# EAGLE design Pro Trinket Keyboard V3.4 (EAGLE 7.3.0)
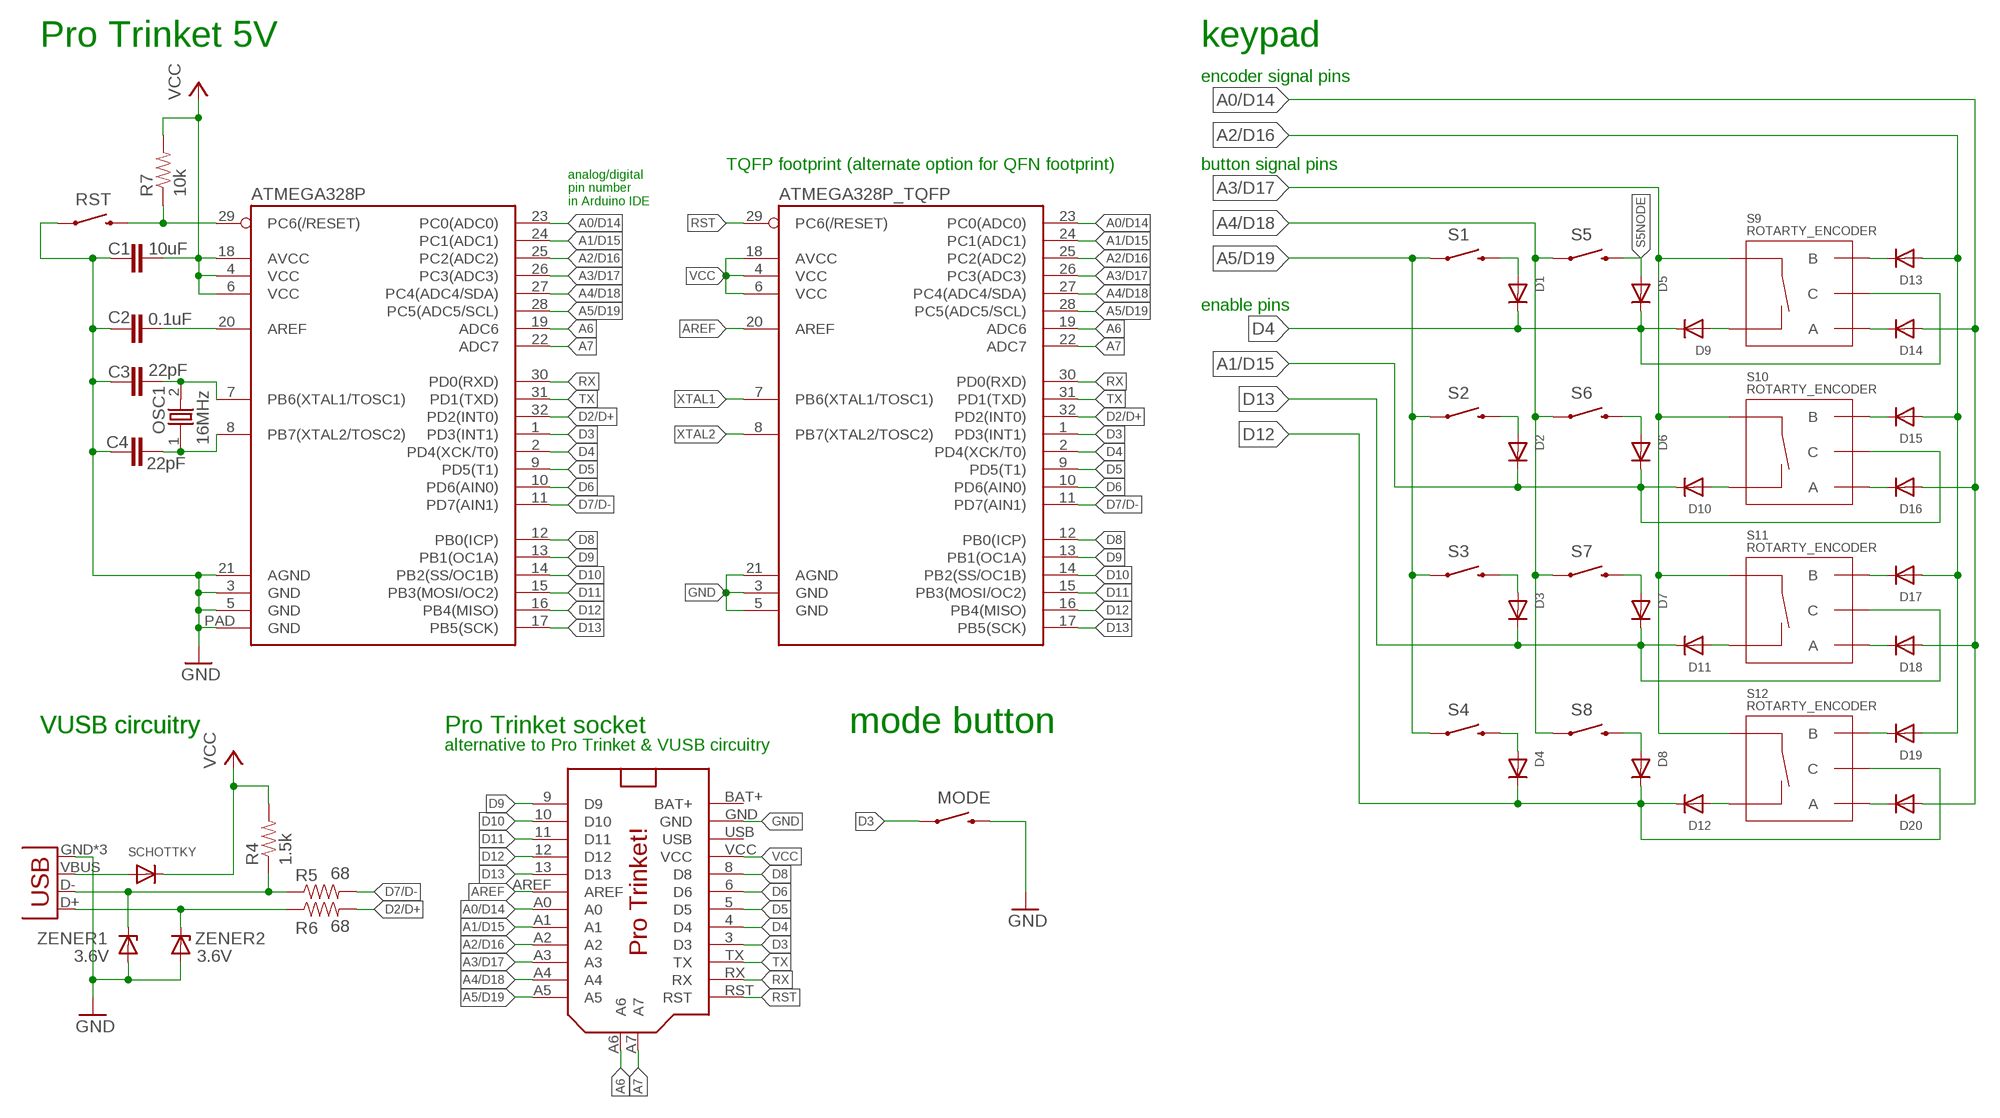
[diagram p0: schematic, sheet 1, part 1 of 2]
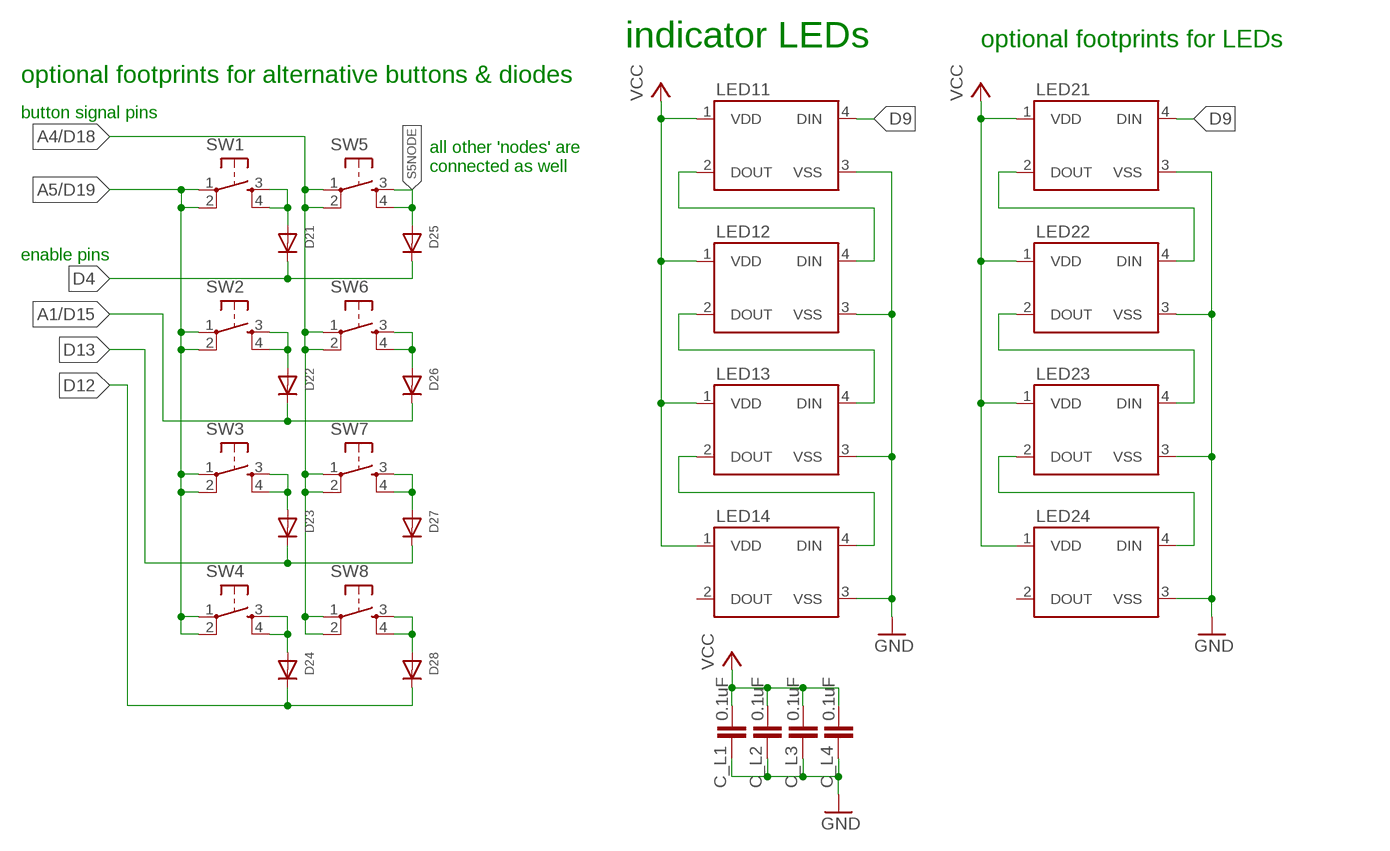
[diagram p1: schematic, sheet 1, part 2 of 2]

## Parts
ATMEGA328P  ATMEGA328P_MLFMLF32  [MLF32-PAD]
ATMEGA328P_TQFP  ATMEGA328P_TQFP  [TQFP32-08]
C1  10uF  10UF-6.3V-20%(0603)  [0603-CAP]
C2  0.1uF  22PF-50V-5%(0603)  [0603-CAP]
C3  22pF  22PF-50V-5%(0603)  [0603-CAP]
C4  22pF  22PF-50V-5%(0603)  [0603-CAP]
C_L1  0.1uF  22PF-50V-5%(0603)  [0603-CAP]
C_L2  0.1uF  22PF-50V-5%(0603)  [0603-CAP]
C_L3  0.1uF  22PF-50V-5%(0603)  [0603-CAP]
C_L4  0.1uF  22PF-50V-5%(0603)  [0603-CAP]
D1  DIODESOD-123  [SOD-123]
D2  DIODESOD-123  [SOD-123]
D3  DIODESOD-123  [SOD-123]
D4  DIODESOD-123  [SOD-123]
D5  DIODESOD-123  [SOD-123]
D6  DIODESOD-123  [SOD-123]
D7  DIODESOD-123  [SOD-123]
D8  DIODESOD-123  [SOD-123]
D9  DIODESOD-123  [SOD-123]
D10  DIODESOD-123  [SOD-123]
D11  DIODESOD-123  [SOD-123]
D12  DIODESOD-123  [SOD-123]
D13  DIODESOD-123  [SOD-123]
D14  DIODESOD-123  [SOD-123]
D15  DIODESOD-123  [SOD-123]
D16  DIODESOD-123  [SOD-123]
D17  DIODESOD-123  [SOD-123]
D18  DIODESOD-123  [SOD-123]
D19  DIODESOD-123  [SOD-123]
D20  DIODESOD-123  [SOD-123]
D21  DIODESOD-123  [SOD-123]
D22  DIODESOD-123  [SOD-123]
D23  DIODESOD-123  [SOD-123]
D24  DIODESOD-123  [SOD-123]
D25  DIODESOD-123  [SOD-123]
D26  DIODESOD-123  [SOD-123]
D27  DIODESOD-123  [SOD-123]
D28  DIODESOD-123  [SOD-123]
LED11  WS2812B  [WS2812B]
LED12  WS2812B  [WS2812B]
LED13  WS2812B  [WS2812B]
LED14  WS2812B  [WS2812B]
LED21  WS2812B  [WS2812B]
LED22  WS2812B  [WS2812B]
LED23  WS2812B  [WS2812B]
LED24  WS2812B  [WS2812B]
MODE  SWITCH-MOMENTARY-2SIDE_EZ  [TACTILE-PTH-SIDEEZ]
OSC1  16MHz  OSC-XTAL-HC-49U-SMD  [HC-49U]
R4  1.5k  RESISTOR0805-RES  [0805]
R5  68  RESISTOR0805-RES  [0805]
R6  68  RESISTOR0805-RES  [0805]
R7  10k  RESISTOR0805-RES  [0805]
RST  SWITCH-MOMENTARY-2SIDE_EZ  [TACTILE-PTH-SIDEEZ]
S1  SWITCH-MOMENTARY-212MM  [TACTILE-PTH-12MM]
S2  SWITCH-MOMENTARY-212MM  [TACTILE-PTH-12MM]
S3  SWITCH-MOMENTARY-212MM  [TACTILE-PTH-12MM]
S4  SWITCH-MOMENTARY-212MM  [TACTILE-PTH-12MM]
S5  SWITCH-MOMENTARY-212MM  [TACTILE-PTH-12MM]
S6  SWITCH-MOMENTARY-212MM  [TACTILE-PTH-12MM]
S7  SWITCH-MOMENTARY-212MM  [TACTILE-PTH-12MM]
S8  SWITCH-MOMENTARY-212MM  [TACTILE-PTH-12MM]
S9  ROTARTY_ENCODER  [ROTARY_ENC_PLAIN]
S10  ROTARTY_ENCODER  [ROTARY_ENC_PLAIN]
S11  ROTARTY_ENCODER  [ROTARY_ENC_PLAIN]
S12  ROTARTY_ENCODER  [ROTARY_ENC_PLAIN]
SCHOTTKY  DIODESMA  [SMADIODE]
SW1  TACTILE-SWITCH-PTH  [TAC-SWITCH-PTH]
SW2  TACTILE-SWITCH-PTH  [TAC-SWITCH-PTH]
SW3  TACTILE-SWITCH-PTH  [TAC-SWITCH-PTH]
SW4  TACTILE-SWITCH-PTH  [TAC-SWITCH-PTH]
SW5  TACTILE-SWITCH-PTH  [TAC-SWITCH-PTH]
SW6  TACTILE-SWITCH-PTH  [TAC-SWITCH-PTH]
SW7  TACTILE-SWITCH-PTH  [TAC-SWITCH-PTH]
SW8  TACTILE-SWITCH-PTH  [TAC-SWITCH-PTH]
U$2  PRO_TRINKET  [PROTRINKET]
UUSB  USB-MICROB  [USB-MICROB]
ZENER1  3.6V  ZENER-DIODESOD80C  [SOD80C]
ZENER2  3.6V  ZENER-DIODESOD80C  [SOD80C]

## Nets
A0/D14: ATMEGA328P.23(PC0(ADC0)) ATMEGA328P_TQFP.23(PC0(ADC0)) D14.A D16.A D18.A D20.A U$2.A0
A1/D15: ATMEGA328P.24(PC1(ADC1)) ATMEGA328P_TQFP.24(PC1(ADC1)) D2.C D6.C D10.C D22.C D26.C S10.C U$2.A1
A2/D16: ATMEGA328P.25(PC2(ADC2)) ATMEGA328P_TQFP.25(PC2(ADC2)) D13.A D15.A D17.A D19.A U$2.A2
A3/D17: ATMEGA328P.26(PC3(ADC3)) ATMEGA328P_TQFP.26(PC3(ADC3)) S9.SW+ S10.SW+ S11.SW+ S12.SW+ U$2.A3
A4/D18: ATMEGA328P.27(PC4(ADC4/SDA)) ATMEGA328P_TQFP.27(PC4(ADC4/SDA)) S5.1 S5.2 S6.1 S6.2 S7.1 S7.2 S8.1 S8.2 SW5.1 SW5.2 SW6.1 SW6.2 SW7.1 SW7.2 SW8.1 SW8.2 U$2.A4
A5/D19: ATMEGA328P.28(PC5(ADC5/SCL)) ATMEGA328P_TQFP.28(PC5(ADC5/SCL)) S1.1 S1.2 S2.1 S2.2 S3.1 S3.2 S4.1 S4.2 SW1.1 SW1.2 SW2.1 SW2.2 SW3.1 SW3.2 SW4.1 SW4.2 U$2.A5
A6: ATMEGA328P.19(ADC6) ATMEGA328P_TQFP.19(ADC6) U$2.A6
A7: ATMEGA328P.22(ADC7) ATMEGA328P_TQFP.22(ADC7) U$2.A7
AREF: ATMEGA328P.20(AREF) ATMEGA328P_TQFP.20(AREF) C2.2 U$2.AREF
D2/D+: ATMEGA328P.32(PD2(INT0)) ATMEGA328P_TQFP.32(PD2(INT0)) R6.2
D3: ATMEGA328P.1(PD3(INT1)) ATMEGA328P_TQFP.1(PD3(INT1)) MODE.1 U$2.3(D3)
D4: ATMEGA328P.2(PD4(XCK/T0)) ATMEGA328P_TQFP.2(PD4(XCK/T0)) D1.C D5.C D9.C D21.C D25.C S9.C U$2.4(D4)
D5: ATMEGA328P.9(PD5(T1)) ATMEGA328P_TQFP.9(PD5(T1)) U$2.5(D5)
D6: ATMEGA328P.10(PD6(AIN0)) ATMEGA328P_TQFP.10(PD6(AIN0)) U$2.6(D6)
D7/D-: ATMEGA328P.11(PD7(AIN1)) ATMEGA328P_TQFP.11(PD7(AIN1)) R5.2
D8: ATMEGA328P.12(PB0(ICP)) ATMEGA328P_TQFP.12(PB0(ICP)) U$2.8(D8)
D9: ATMEGA328P.13(PB1(OC1A)) ATMEGA328P_TQFP.13(PB1(OC1A)) LED11.4(DIN) LED21.4(DIN) U$2.9(D9)
D10: ATMEGA328P.14(PB2(SS/OC1B)) ATMEGA328P_TQFP.14(PB2(SS/OC1B)) U$2.10(D10)
D11: ATMEGA328P.15(PB3(MOSI/OC2)) ATMEGA328P_TQFP.15(PB3(MOSI/OC2)) U$2.11(D11)
D12: ATMEGA328P.16(PB4(MISO)) ATMEGA328P_TQFP.16(PB4(MISO)) D4.C D8.C D12.C D24.C D28.C S12.C U$2.12(D12)
D13: ATMEGA328P.17(PB5(SCK)) ATMEGA328P_TQFP.17(PB5(SCK)) D3.C D7.C D11.C D23.C D27.C S11.C U$2.13(D13)
GND: ATMEGA328P.3(GND) ATMEGA328P.5(GND) ATMEGA328P.21(AGND) ATMEGA328P.PAD(GND) ATMEGA328P_TQFP.3(GND) ATMEGA328P_TQFP.5(GND) ATMEGA328P_TQFP.21(AGND) C1.1 C2.1 C3.1 C4.2 C_L1.1 C_L2.1 C_L3.1 C_L4.1 LED11.3(VSS) LED12.3(VSS) LED13.3(VSS) LED14.3(VSS) LED21.3(VSS) LED22.3(VSS) LED23.3(VSS) LED24.3(VSS) MODE.2 RST.1 U$2.GND UUSB.GND UUSB.MT1(GND) UUSB.MT2(GND) ZENER1.A ZENER2.A
L1NODE: LED11.2(DOUT) LED12.4(DIN) LED21.2(DOUT) LED22.4(DIN)
L2NODE: LED12.2(DOUT) LED13.4(DIN) LED22.2(DOUT) LED23.4(DIN)
L3NODE: LED13.2(DOUT) LED14.4(DIN) LED23.2(DOUT) LED24.4(DIN)
N$10: SCHOTTKY.A UUSB.VBUS
N$11: R4.1 R5.1 UUSB.D- ZENER1.C
N$12: R6.1 UUSB.D+ ZENER2.C
N$34: D10.A S10.SW-
N$35: D9.A S9.SW-
N$36: D11.A S11.SW-
N$37: D20.C S12.A
N$38: D19.C S12.B
N$39: D18.C S11.A
N$40: D12.A S12.SW-
N$41: D16.C S10.A
N$42: D15.C S10.B
N$43: D14.C S9.A
N$44: D13.C S9.B
N$45: D17.C S11.B
RST: ATMEGA328P.29(PC6(/RESET)) ATMEGA328P_TQFP.29(PC6(/RESET)) R7.1 RST.2 U$2.RST
RX: ATMEGA328P.30(PD0(RXD)) ATMEGA328P_TQFP.30(PD0(RXD)) U$2.RX
S1NODE: D1.A D21.A S1.3 S1.4 SW1.3 SW1.4
S2NODE: D2.A D22.A S2.3 S2.4 SW2.3 SW2.4
S3NODE: D3.A D23.A S3.3 S3.4 SW3.3 SW3.4
S4NODE: D4.A D24.A S4.3 S4.4 SW4.3 SW4.4
S5NODE: D5.A D25.A S5.3 S5.4 SW5.3 SW5.4
S6NODE: D6.A D26.A S6.3 S6.4 SW6.3 SW6.4
S7NODE: D7.A D27.A S7.3 S7.4 SW7.3 SW7.4
S8NODE: D8.A D28.A S8.3 S8.4 SW8.3 SW8.4
TX: ATMEGA328P.31(PD1(TXD)) ATMEGA328P_TQFP.31(PD1(TXD)) U$2.TX
VCC: ATMEGA328P.4(VCC) ATMEGA328P.6(VCC) ATMEGA328P.18(AVCC) ATMEGA328P_TQFP.4(VCC) ATMEGA328P_TQFP.6(VCC) ATMEGA328P_TQFP.18(AVCC) C1.2 C_L1.2 C_L2.2 C_L3.2 C_L4.2 LED11.1(VDD) LED12.1(VDD) LED13.1(VDD) LED14.1(VDD) LED21.1(VDD) LED22.1(VDD) LED23.1(VDD) LED24.1(VDD) R4.2 R7.2 SCHOTTKY.C U$2.VCC
XTAL1: ATMEGA328P.7(PB6(XTAL1/TOSC1)) ATMEGA328P_TQFP.7(PB6(XTAL1/TOSC1)) C3.2 OSC1.2
XTAL2: ATMEGA328P.8(PB7(XTAL2/TOSC2)) ATMEGA328P_TQFP.8(PB7(XTAL2/TOSC2)) C4.1 OSC1.1
Unconnected: LED14.2(DOUT) LED24.2(DOUT)

## Notes on the sheet
- Pro Trinket 5V | keypad | indicator LEDs | optional footprints for LEDs
- encoder signal pins | optional footprints for alternative buttons & diodes
- button signal pins
- TQFP footprint (alternate option for QFN footprint) | button signal pins
- all other 'nodes' are
  connected as well
- analog/digital
  pin number
  in Arduino IDE
- enable pins
- enable pins
- VUSB circuitry | VUSB circuitry | Pro Trinket socket | mode button
- alternative to Pro Trinket & VUSB circuitry

## Power pins joined to a net without a drawn wire
BAT+: U$2.BAT+
USB: U$2.USB

## Library data of the parts
ATMEGA328P = SparkFun-DigitalIC:ATMEGA328P_MLF: 32-Pin Atmega328 part Commonly used on Arduino compatible boards Available in QFP and QFN packages TQFP is IC-09069 QFN is non-stock
ATMEGA328P_TQFP = SparkFun-DigitalIC:ATMEGA328P_TQFP; PROD_ID: IC-09069; VALUE: ATMEGA328P_TQFP
C1 = SparkFun-Capacitors:10UF-6.3V-20%(0603): CAP-11015; PROD_ID: CAP-11015
C2 C_L1-C_L4 = SparkFun-Capacitors:22PF-50V-5%(0603): CAP-07876; PROD_ID: CAP-07876; VALUE: 22pF
C3 C4 = SparkFun-Capacitors:22PF-50V-5%(0603): CAP-07876; PROD_ID: CAP-07876
D1-D28 SCHOTTKY = adafruit:DIODE: Diode SMADIODE - SMA Surface Mount Package 20V 1A Schottky Diode Digikey: 641-1014-6-ND DO-1N4148 - Through Hole Small Current Diode SOD-123 20V 1 A (.5mV Vf) Schottky Diode - Digikey: MBRX120TPMSCT-ND SOD-323 10V 570mA (.38mV Vf, 3ns) Schottky Diode - Digikey: ZLLS410CT-ND SOD-523 30V 30mA Schottky Diode (RB751S-40TE61) - Digikey: RB751S-40TE61CT-ND SOT23-R/W - SOT23 Package (R = Solder Paste/Reflow Ovens, W = Hand-Soldering) BAT54Film 40V 300mA - Digikey: 497-7162-1-ND
LED11-LED14 LED21-LED24 = SparkFun-LED:WS2812B: WS2812B - Intelligent control LED integrated light source Technical Specifications: Power Supply Voltage (VDD): 3.5 to 5.3 V Input Voltage (VI): -0.5 to VDD+0.5 V Operating Junction Temperature (Topt): -25°C to +80°C Storage Temperature Range (Tstg): -55°C to +150°C
MODE RST = SparkFun-Electromechanical:SWITCH-MOMENTARY-2: Various NO switches- pushbuttons, reed, etc
OSC1 = dp_devices:OSC-XTAL
R4-R7 = SparkFun-Passives:RESISTOR: Resistor Basic schematic elements and footprints for 0603, 1206, and PTH resistors.
S1-S8 = SparkFun-Electromechanical:SWITCH-MOMENTARY-2: Various NO switches- pushbuttons, reed, etc; PROD_ID: SWCH-09185
S9-S12 = SparkFun-Electromechanical:ROTARTY_ENCODER: Simple no LED rotary encoder Example: COM-09117
SW1-SW8 = GeekAmmo:TACTILE-SWITCH: Tactile Switch 4 Pins, SPST NO
U$2 = adafruit:PRO_TRINKET
UUSB = SparkFun-Connectors:USB: USB Connectors USB-B-PTH is fully proven SKU : PRT-00139/CONN-08278 USB-miniB is fully proven SKU : PRT-00587 USB-A-PCB is untested. USB-A-H is throughly reviewed, but untested. Spark Fun Electronics SKU : PRT-00437 USB-B-SMT is throughly reviewed, but untested. Needs silkscreen touching up. USB-A-S has not been used/tested USB-MB-H has not been used/tested USB-MICROB has been used. CONN-09505; PROD_ID: CONN-09505
ZENER1 ZENER2 = diode:ZENER-DIODE: Z-Diode

## Board
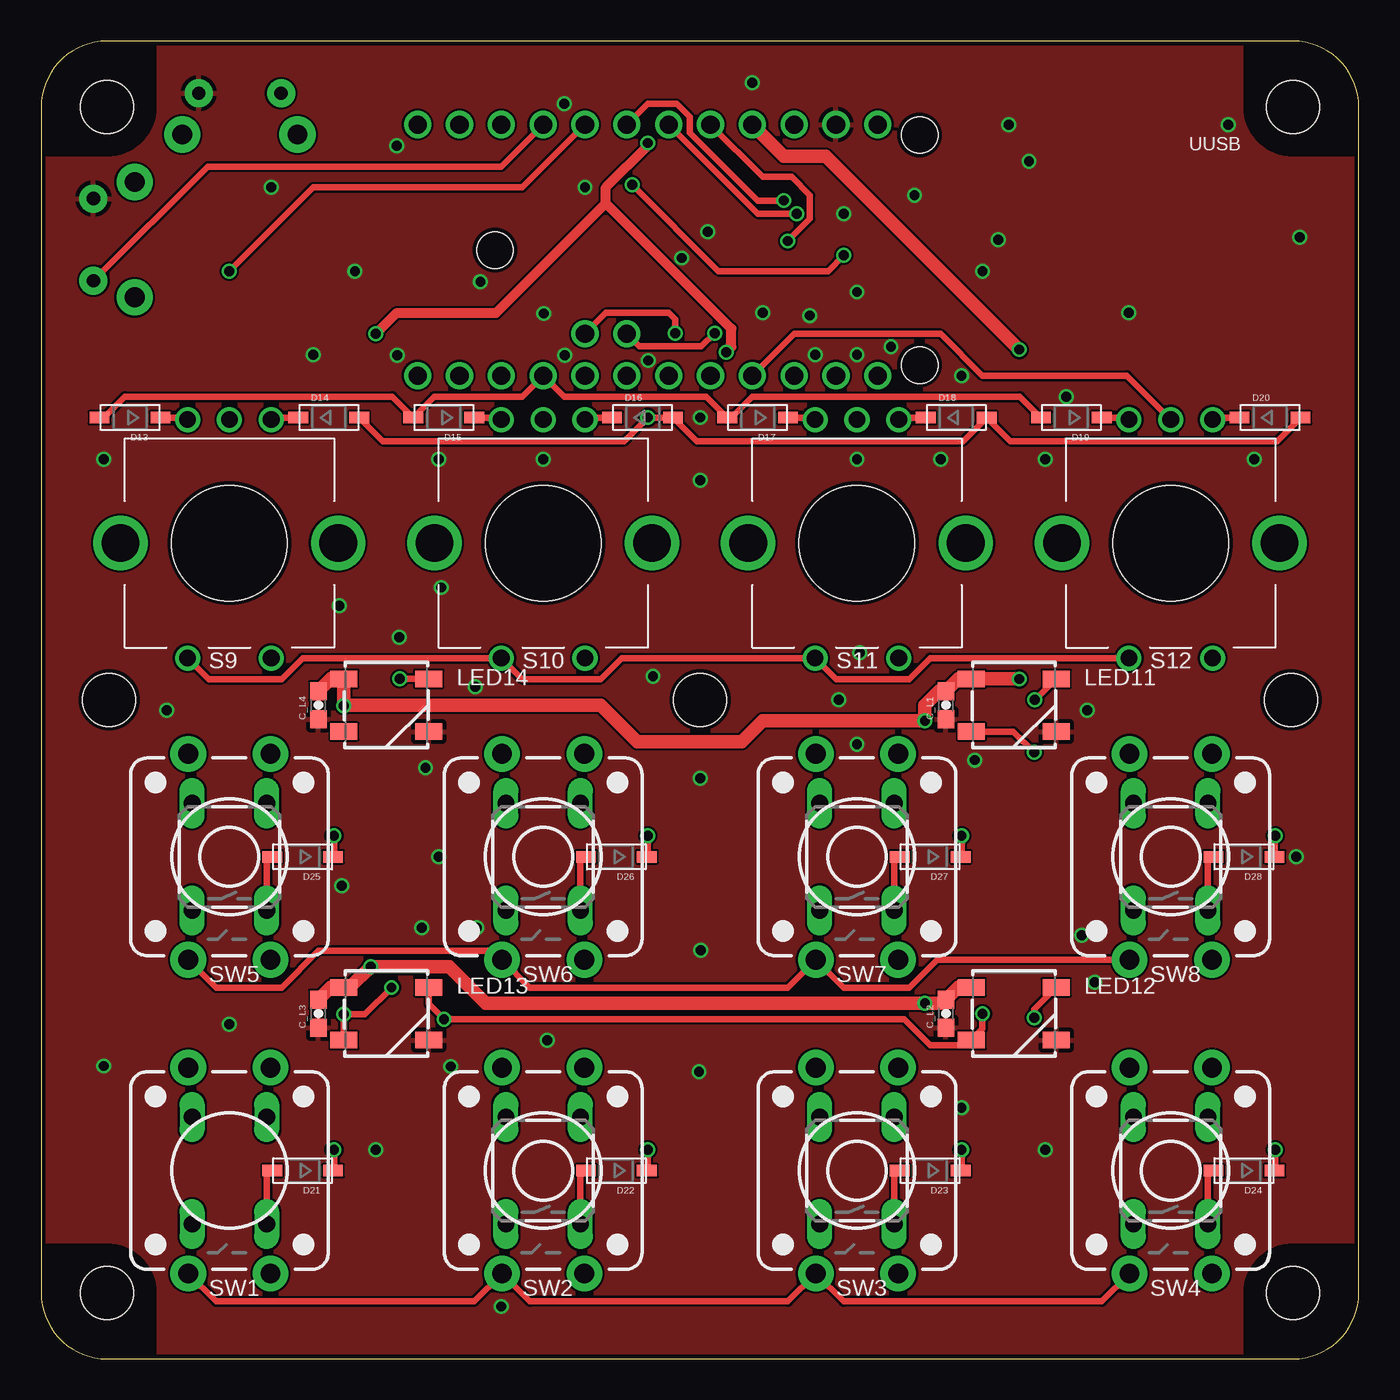
[diagram p2: board, top side]
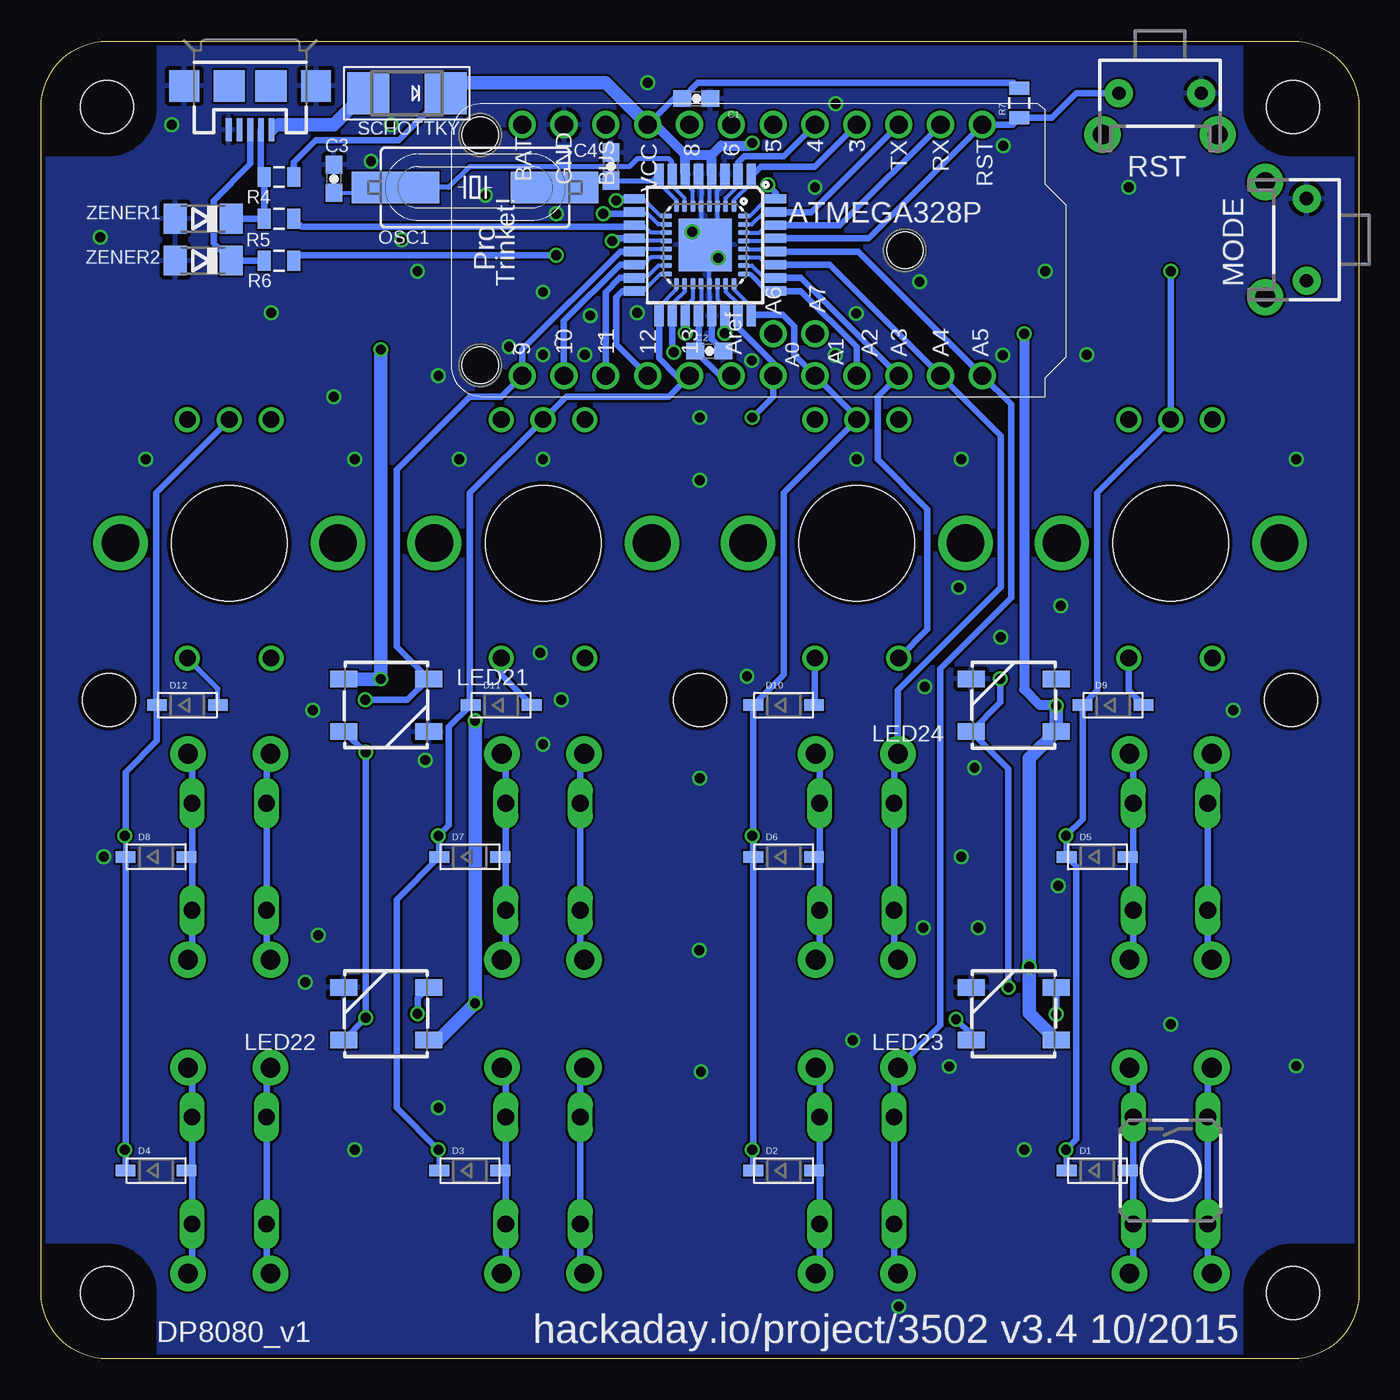
[diagram p3: board, bottom side, seen from below]

Size 80 x 80 mm. Coordinates in mm from the lower left corner, seen from the top.
Copper layers (1*16): Top 0.035mm / dielectric 1.5mm / Bottom 0.035mm
Design rules "dirt_cheap_dirty_boards.v1": minimum track width 5mil, minimum drill 12mil, track to track 5mil, track to pad 5mil, pad to pad 5mil, via to via 5mil, smd to smd 0mil, copper to edge 10mil, drill to drill 10mil, minimum pad ring 10mil, minimum via ring 6mil, stop-mask expansion 2mil, vias tented up to drill 25mil, thermal gap 10mil
Holes 7 mm at 11.43,49.53 30.48,49.53 49.53,49.53 68.58,49.53
Holes 3.2 mm at 40.01,40.01 4.13,40.01 75.88,40.01

### Footprints (pad centres in the part's own frame; a part is rotated, then mirrored left to right if it is on the bottom)
MLF32-PAD = smd 0.7 x 0.3: 1 -2.35,1.75; 2 -2.35,1.25; 3 -2.35,0.75; 4 -2.35,0.25; 5 -2.35,-0.25; 6 -2.35,-0.75; 7 -2.35,-1.25; 8 -2.35,-1.75; 17 2.35,-1.75; 18 2.35,-1.25; 19 2.35,-0.75; 20 2.35,-0.25; 21 2.35,0.25; 22 2.35,0.75; 23 2.35,1.25; 24 2.35,1.75 | smd 0.3 x 0.7: 9 -1.75,-2.35; 10 -1.25,-2.35; 11 -0.75,-2.35; 12 -0.25,-2.35; 13 0.25,-2.35; 14 0.75,-2.35; 15 1.25,-2.35; 16 1.75,-2.35; 25 1.75,2.35; 26 1.25,2.35; 27 0.75,2.35; 28 0.25,2.35; 29 -0.25,2.35; 30 -0.75,2.35; 31 -1.25,2.35; 32 -1.75,2.35 | smd 3.2 x 3.2: PAD 0,0
TQFP32-08 = smd 1.27 x 0.559: 1 -4.293,2.8; 2 -4.293,2; 3 -4.293,1.2; 4 -4.293,0.4; 5 -4.293,-0.4; 6 -4.293,-1.2; 7 -4.293,-2; 8 -4.293,-2.8; 17 4.293,-2.8; 18 4.293,-2; 19 4.293,-1.2; 20 4.293,-0.4; 21 4.293,0.4; 22 4.293,1.2; 23 4.293,2; 24 4.293,2.8 | smd 0.559 x 1.27: 9 -2.8,-4.293; 10 -2,-4.293; 11 -1.2,-4.293; 12 -0.4,-4.293; 13 0.4,-4.293; 14 1.2,-4.293; 15 2,-4.293; 16 2.8,-4.293; 25 2.8,4.293; 26 2,4.293; 27 1.2,4.293; 28 0.4,4.293; 29 -0.4,4.293; 30 -1.2,4.293; 31 -2,4.293; 32 -2.8,4.293
0603-CAP = smd 1.1 x 1: 1 -0.85,0; 2 0.85,0
SOD-123 = smd 1.2 x 0.7: A 1.85,0; C -1.85,0
WS2812B = smd 1.651 x 1: 1 -2.577,1.6; 2 -2.577,-1.6; 3 2.577,-1.6; 4 2.577,1.6
TACTILE-PTH-SIDEEZ = drill 0.8 pad 1.7: 1 -2.5,0; 2 2.5,0 | drill 1.2 pad 2.2: ANCHOR1 -3.5,2.5; ANCHOR2 3.5,2.5
HC-49U = smd 5.334 x 1.93: 1 -4.826,0; 2 4.826,0
0805 = smd 0.8 x 1.2: 1 -0.9,0; 2 0.9,0
TACTILE-PTH-12MM = drill 1.2 pad 2.159: 1 6.25,-2.5; 2 -6.25,-2.5; 3 6.25,2.5; 4 -6.25,2.5
ROTARY_ENC_PLAIN = drill 1.016: A 7.493,-2.54; B 7.493,2.54; C 7.493,0; SW+ -6.985,2.54; SW- -6.985,-2.54 | drill 2.286: P$3 0,6.604; P$4 0,-6.604
SMADIODE = smd 2.54 x 2.54: A 2.349,0; C -2.349,0
TAC-SWITCH-PTH = drill 1.016 pad 1.524 long: 1 -3.251,2.261; 2 3.251,2.261; 3 -3.251,-2.261; 4 3.251,-2.261
DP8080_V1 = hole 3.2: 4,4; 76,4; 76,76; 4,76
PROTRINKET = drill 1.1: 3 7.62,2.921; 4 7.62,5.461; 5 7.62,8.001; 6 7.62,10.541; 8 7.62,13.081; 9 -7.62,23.241; 10 -7.62,20.701; 11 -7.62,18.161; 12 -7.62,15.621; 13 -7.62,13.081; A0 -7.62,8.001; A1 -7.62,5.461; A2 -7.62,2.921; A3 -7.62,0.381; A4 -7.62,-2.159; A5 -7.62,-4.699; A6 -5.08,8.001; A7 -5.08,5.461; AREF -7.62,10.541; BAT+ 7.62,23.241; GND 7.62,20.701; RST 7.62,-4.699; RX 7.62,-2.159; TX 7.62,0.381; USB 7.62,18.161; VCC 7.62,15.621 | hole 2.2: -6.985,25.781; 6.985,25.781; 0,0
USB-MICROB = smd 0.35 x 1.4: D+ 0,2.65; D- -0.65,2.65; GND 1.3,2.65; ID 0.65,2.65; VBUS -1.3,2.65 | smd 1.8 x 1.9: MT1 -4,0; MT2 4,0 | smd 1.9 x 1.9: P$1 -1.27,0; P$2 1.27,0
SOD80C = smd 1.4 x 1.8: A 1.7,0; C -1.7,0

### Placement (x,y rotation side)
ATMEGA328P  39.69,67.63 270 bottom
ATMEGA328P_TQFP  39.69,67.63 270 bottom
C1  40.23,76.52 180 bottom
C2  39.43,61.18 180 bottom
C3  62.23,71.65 270 bottom
C4  45.4,72.39 90 bottom
C_L1  54.93,39.69 90 top
C_L2  54.93,20.95 90 top
C_L3  16.83,20.95 90 top
C_L4  16.83,39.69 90 top
D1  15.88,11.43 0 bottom
D2  34.92,11.43 0 bottom
D3  53.98,11.43 0 bottom
D4  73.03,11.43 0 bottom
D5  15.88,30.48 0 bottom
D6  34.92,30.48 0 bottom
D7  53.98,30.48 0 bottom
D8  73.03,30.48 0 bottom
D9  14.92,39.69 0 bottom
D10  34.92,39.69 0 bottom
D11  52.07,39.69 0 bottom
D12  71.12,39.69 0 bottom
D13  5.4,57.15 180 top
D14  17.46,57.15 0 top
D15  24.45,57.15 180 top
D16  36.51,57.15 0 top
D17  43.5,57.15 180 top
D18  55.56,57.15 0 top
D19  62.55,57.15 180 top
D20  74.61,57.15 0 top
D21  15.88,11.43 180 top
D22  34.92,11.43 180 top
D23  53.98,11.43 180 top
D24  73.03,11.43 180 top
D25  15.88,30.48 180 top
D26  34.92,30.48 180 top
D27  53.98,30.48 180 top
D28  73.03,30.48 180 top
LED11  59.05,39.69 0 top
LED12  59.05,20.95 0 top
LED13  20.95,20.95 0 top
LED14  20.95,39.69 0 top
LED21  59.05,39.69 0 bottom
LED22  59.05,20.95 180 bottom
LED23  20.95,20.95 180 bottom
LED24  20.95,39.69 180 bottom
MODE  3.17,67.94 90 bottom
OSC1  53.66,71.12 180 bottom
R4  65.56,71.75 0 bottom
R5  65.56,69.22 0 bottom
R6  65.56,66.67 0 bottom
R7  20.62,76.24 90 bottom
RST  12.06,76.83 180 bottom
S1  11.43,11.43 270 top
S2  30.48,11.43 270 top
S3  49.53,11.43 270 top
S4  68.58,11.43 270 top
S5  11.43,30.48 270 top
S6  30.48,30.48 270 top
S7  49.53,30.48 270 top
S8  68.58,30.48 270 top
S9  11.43,49.53 90 top
S10  30.48,49.53 90 top
S11  49.53,49.53 90 top
S12  68.58,49.53 90 top
SCHOTTKY  57.78,76.83 180 bottom
SW1  11.43,11.43 270 bottom
SW2  30.48,11.43 90 top
SW3  49.53,11.43 90 top
SW4  68.58,11.43 90 top
SW5  11.43,30.48 90 top
SW6  30.48,30.48 90 top
SW7  49.53,30.48 90 top
SW8  68.58,30.48 90 top
U$1  [DP8080_V1]  0,0 0 top
U$2  27.56,67.32 90 bottom
UUSB  67.31,77.28 180 bottom
ZENER1  70.17,69.22 180 bottom
ZENER2  70.17,66.67 180 bottom

### Tracks (layer width: path | path; a pad name or v marks a point on that pad's centre or on a via)
A0/D14  (via drill 0.6)
  Top 0.406: D14.A 20.74,55.72 35.4,55.72 v36.83,57.15 D16.A 39.79,55.72 55.98,55.72 D18.A 58.84,55.72 75.03,55.72 D20.A
  Bottom 0.254: ATMEGA328P.23 38.44,64.79 37.78,64.14 37.78,63.43 ATMEGA328P_TQFP.23
  Bottom 0.406: v36.83,57.15 35.56,58.42 U$2.A0 35.56,60.48 37.69,62.61 ATMEGA328P_TQFP.23
A1/D15  (via drill 0.6)
  Top 0.406: D22.C 36.83,11.43 v36.83,12.7 | D26.C 36.83,30.54 v36.83,31.75
  Bottom 0.254: ATMEGA328P.24 37.94,64.92 36.83,63.82 36.83,63.39 ATMEGA328P_TQFP.24
  Bottom 0.406: D22.C 36.77,12.7 | 36.77,12.7 D26.C 36.77,31.75 | 36.77,31.75 D10.C 34.92,41.54 34.92,52.58 S10.C 30.48,57.16 U$2.A1 34.29,60.97 34.29,62.71 34.98,63.39 36.83,63.39 | v36.83,12.7 36.77,12.7 | v36.83,31.75 36.77,31.75
A2/D16
  Top 0.305: D17.A 41.91,57.15
  Top 0.406: D17.A 40.38,58.42 31.75,58.42 U$2.A2 29.2,58.42 23.87,58.42 D15.A 21.33,58.42 5.08,58.42 3.81,57.15 D13.A | 41.91,57.15 43.18,58.42 59.43,58.42 D19.A
  Bottom 0.305: ATMEGA328P.25 36.98,65.88 35.88,64.77 35.45,64.77 ATMEGA328P_TQFP.25
  Bottom 0.406: U$2.A2 30.48,61.43 33.87,64.83 ATMEGA328P_TQFP.25
A3/D17
  Top 0.406: S12.SW+ 53.98,42.55 52.7,41.27 48.26,41.27 S11.SW+ 35.24,42.55 33.97,41.27 29.21,41.27 S10.SW+ 15.88,42.55 14.61,41.27 10.16,41.27 S9.SW+
  Bottom 0.254: ATMEGA328P.26 36.85,66.38 36.2,65.72 35.49,65.72 ATMEGA328P_TQFP.26
  Bottom 0.406: ATMEGA328P_TQFP.26 33.87,65.63 U$2.A3 29.21,58.42 29.21,54.61 26.19,51.59 26.19,44.29 S10.SW+
A4/D18
  Top 0.406: S8.1 54.39,24.23 52.7,22.54 48.72,22.54 S7.1 45.34,22.54 29.67,22.54 S6.1 27.45,24.77 16.83,24.77 14.61,22.54 10.62,22.54 S5.1
  Bottom 0.254: ATMEGA328P.27 36.4,66.88 35.88,66.36 35.47,66.36 ATMEGA328P_TQFP.27
  Bottom 0.305: 27.98,36.79 S6.2
  Bottom 0.406: S8.2 66.32,36.49 SW8.2 SW8.1 66.32,24.47 S8.1 | S7.2 47.27,36.49 SW7.2 SW7.1 47.27,24.47 S7.1 | S6.1 28.22,24.47 SW6.1 SW6.2 28.22,36.49 S6.2 27.98,40.6 21.75,46.83 21.75,56.05 U$2.A4 32.13,66.43 ATMEGA328P_TQFP.27 | S5.2 9.17,36.49 SW5.2 SW5.1 9.17,24.47 S5.1
A5/D19
  Top 0.406: S4.1 64.39,3.49 48.72,3.49 S3.1 45.34,3.49 29.67,3.49 S2.1 26.29,3.49 10.62,3.49 S1.1
  Bottom 0.254: ATMEGA328P.28 35.4,67.38 ATMEGA328P_TQFP.28
  Bottom 0.406: S1.2 9.17,17.44 SW1.1 SW1.2 9.17,5.42 S1.1 | S2.1 28.22,5.42 SW2.1 SW2.2 28.22,17.44 S2.2 25.4,20.26 25.4,41.91 21.11,46.2 21.11,57.95 U$2.A5 30.39,67.23 ATMEGA328P_TQFP.28 | S3.2 47.27,17.44 SW3.2 SW3.1 47.27,5.42 S3.1 | S4.2 66.32,17.44 SW4.2 SW4.1 66.32,5.42 S4.1
A6  (via drill 0.6)
  Top 0.406: U$2.A6 36.33,61.47 40.09,61.47 v40.89,62.27
  Bottom 0.254: ATMEGA328P.19 40.44,64.34 40.96,63.82 40.96,63.41 ATMEGA328P_TQFP.19
  Bottom 0.406: ATMEGA328P_TQFP.19 v40.89,62.27
A7  (via drill 0.6)
  Top 0.406: v38.49,62.27 38.49,63.11 38.1,63.5 34.28,63.5 U$2.A7
  Bottom 0.254: ATMEGA328P.22 38.94,64.34 38.42,63.82 38.42,63.41 ATMEGA328P_TQFP.22
  Bottom 0.406: ATMEGA328P_TQFP.22 v38.49,62.27
AREF
  Bottom 0.254: ATMEGA328P.20 39.94,63.48 ATMEGA328P_TQFP.20
  Bottom 0.406: ATMEGA328P_TQFP.20 40.09,61.39 C2.2 38.78,59.7 U$2.AREF
D2/D+  (via drill 0.6)
  Top 0.406: v35.88,71.28 41.12,66.04 47.78,66.04 v48.74,66.99
  Bottom 0.254: ATMEGA328P.32 36.98,69.38 35.94,70.43 ATMEGA328P_TQFP.32
  Bottom 0.406: v48.74,66.99 64.35,66.99 R6.2 | ATMEGA328P_TQFP.32 35.4,70.8 v35.88,71.28
D3
  Top 0.406: U$2.3 30.48,74.93 27.94,72.39 10.12,72.39 MODE.1
  Bottom 0.254: ATMEGA328P.1 37.94,70.33 36.83,71.44 36.83,71.86 ATMEGA328P_TQFP.1
  Bottom 0.406: 36.83,71.86 36.3,72.39 33.02,72.39 U$2.3
D4  (via drill 0.6)
  Top 0.406: v17.78,12.7 17.78,11.48 D21.C | D25.C 17.78,30.54 v17.78,31.75 | v11.43,66.04 16.51,71.12 29.2,71.12 U$2.4
  Bottom 0.254: ATMEGA328P.2 38.44,70.47 37.78,71.12 37.78,71.83 ATMEGA328P_TQFP.2
  Bottom 0.406: D21.C 17.73,12.7 v17.78,12.7 17.14,13.34 17.14,29.9 D25.C 17.73,31.75 v17.78,31.75 16.77,32.76 D9.C 15.88,40.59 15.88,52.58 S9.C v11.43,66.04 | U$2.4 34.93,73.03 37.31,73.03 37.69,72.64 ATMEGA328P_TQFP.2
D5  (via drill 0.6)
  Top 0.406: U$2.5 36.82,76.2 38.58,76.2 39.37,75.41 39.37,74.45 43.5,70.33 v45.09,70.33
  Bottom 0.254: ATMEGA328P.9 42.39,69.38 43.5,70.48 43.92,70.48 ATMEGA328P_TQFP.9
  Bottom 0.406: ATMEGA328P_TQFP.9 44.98,70.43 v45.09,70.33
D6  (via drill 0.6)
  Top 0.406: U$2.6 43.5,69.53 v45.88,69.53
  Bottom 0.254: ATMEGA328P.10 42.52,68.88 43.18,69.53 43.88,69.53 ATMEGA328P_TQFP.10
  Bottom 0.406: ATMEGA328P_TQFP.10 44.08,69.53 v45.88,69.53
D7/D-
  Bottom 0.254: ATMEGA328P.11 42.98,68.38 43.5,68.9 43.91,68.9 ATMEGA328P_TQFP.11
  Bottom 0.406: ATMEGA328P_TQFP.11 44.07,68.74 64.19,68.74 R5.2
D8  (via drill 0.6)
  Top 0.406: v45.33,67.87 46.67,69.22 46.67,70.64 45.56,71.75 43.82,71.75 U$2.8
  Bottom 0.254: ATMEGA328P.12 43.83,67.88 ATMEGA328P_TQFP.12
  Bottom 0.406: ATMEGA328P_TQFP.12 45.17,68.03 v45.33,67.87
D9  (via drill 0.6)
  Top 0.406: LED11.4 60.35,40.01 v60.33,40.01
  Bottom 0.254: ATMEGA328P.13 43.98,67.38 ATMEGA328P_TQFP.13
  Bottom 0.305: U$2.9
  Bottom 0.406: U$2.9 52.07,58.42 53.98,58.42 58.42,53.98 58.42,43.23 LED21.4 57.76,40.01 v60.33,40.01 | ATMEGA328P_TQFP.13 44.85,67.23 50.8,61.28 U$2.9
D10
  Bottom 0.254: ATMEGA328P.14 42.98,66.88 43.43,66.43 ATMEGA328P_TQFP.14
  Bottom 0.406: ATMEGA328P_TQFP.14 44.86,66.43 48.26,63.02 U$2.10
D11
  Bottom 0.254: ATMEGA328P.15 42.52,66.38 43.18,65.72 43.88,65.72 ATMEGA328P_TQFP.15
  Bottom 0.406: ATMEGA328P_TQFP.15 44.86,65.63 45.72,64.77 U$2.11
D12  (via drill 0.6)
  Top 0.406: D24.C 74.93,11.48 v74.93,12.7 | D28.C 74.88,30.43 v74.93,31.75 | S12.C 65.91,59.69 57.15,59.69 54.61,62.23 45.71,62.23 U$2.12
  Bottom 0.254: ATMEGA328P.16 42.39,65.88 43.44,64.83 ATMEGA328P_TQFP.16
  Bottom 0.305: 73.03,39.74 D12.C | D28.C 74.88,31.75
  Bottom 0.406: D24.C 74.88,12.7 | 74.88,12.7 D28.C | D12.C 72.97,37.52 74.88,35.62 74.88,31.75 v74.93,31.75 | v74.93,12.7 74.88,12.7 | ATMEGA328P_TQFP.16 44.71,64.83 45.09,64.45 45.09,61.6 U$2.12 | 73.03,39.74 73.03,52.58 S12.C
D13  (via drill 0.6)
  Top 0.406: D23.C 55.88,11.48 v55.88,12.7 | D27.C 55.88,30.54 v55.88,31.75
  Bottom 0.254: ATMEGA328P.17 41.44,64.92 42.55,63.82 42.55,63.39 ATMEGA328P_TQFP.17
  Bottom 0.305: D23.C 55.83,12.7
  Bottom 0.406: 55.83,12.7 v55.88,12.7 58.42,15.24 58.42,27.89 D27.C 55.83,31.7 v55.88,31.75 55.24,32.38 55.24,38.36 D11.C 53.98,39.74 53.98,52.58 S11.C 48.13,58.42 41.91,58.42 U$2.13 41.43,59.69 42.49,60.74 ATMEGA328P_TQFP.17
GND  (via drill 0.6)
  Bottom 0.254: ATMEGA328P_TQFP.5 39.94,71.92 ATMEGA328P.5 39.94,67.88 ATMEGA328P.PAD | ATMEGA328P_TQFP.3 38.42,71.85 38.42,71.44 38.94,70.92 ATMEGA328P.3 38.94,68.38 ATMEGA328P.PAD | ATMEGA328P.PAD 39.44,67.38 ATMEGA328P.21 39.44,63.48 ATMEGA328P_TQFP.21
  Bottom 0.406: ATMEGA328P_TQFP.21 39.29,61.9 C2.1
  other vias: 43.81,63.5 19.05,66.04 66.04,63.5 63.5,39.37 40.01,35.24 7.62,39.37 24.13,54.61 54.61,54.61 39.94,17.43 60.96,12.7 20.32,12.7 76.2,30.48 3.81,17.78 16.51,60.96 40.04,24.8 27.94,3.17 24.13,30.48 3.81,54.61 59.98,72.71 76.42,68.1 60.96,54.61 49.53,54.61 40.01,57.15 11.43,20.32 26.67,65.41 55.88,15.24 31.75,76.2 49.53,64.77 40.01,53.34 36.86,60.61 40.48,68.42 38.89,66.83 18.26,28.73 18.1,45.72 24.29,46.83 26.35,40.8 21.75,43.81 23.34,35.88 37.15,41.43 48.42,40.01 49.69,42.86 49.53,37.31 56.67,36.35 63.98,22.86 63.18,25.72 30.73,19.34 24.86,17.75 26.45,26.16 23.11,26.16 46.99,60.96 43.18,77.47 57.15,66.04 58.1,67.94 53.02,70.64 48.74,69.53 72.07,74.93 46.67,63.34 49.53,60.96 51.59,61.44 55.88,59.69 62.23,58.42 73.66,54.61 30.48,54.61 31.78,60.93 21.62,60.93 30.51,63.47 33.02,71.12 21.59,73.66 13.97,71.12 58.74,74.93 76.2,30.48
  pour Bottom (rank 6): 0,80.01 80.01,80.01 80.01,0 0,0
  pour Top: 0,80.01 80.01,80.01 80.01,0 0,0
L1NODE  (via drill 0.6)
  Top 0.406: LED11.2 59.02,38.09 v60.29,36.82 | v60.29,20.7 60.29,21.21 LED12.4
  Bottom 0.406: LED21.2 v60.29,36.82 v60.29,20.7 LED22.4
L2NODE  (via drill 0.6)
  Top 0.406: v57.15,20.95 57.15,20.03 LED12.2 56.17,19.05 53.98,19.05 52.4,20.62 v24.46,20.62 23.53,21.55 LED13.4
  Bottom 0.406: LED22.2 57.15,21.88 v57.15,20.95 | v24.46,20.62 23.53,19.7 LED23.4
L3NODE  (via drill 0.6)
  Top 0.406: LED13.2 v18.38,20.92 19.65,20.92 v21.27,22.54 | LED14.4 v21.76,41.29
  Bottom 0.406: v21.27,22.54 21.27,35.83 LED24.4 21.76,39.86 v21.76,41.29 | v18.38,20.92 LED23.2
N$10
  Bottom 0.406: 65.88,74.61 65.9,74.63 UUSB.VBUS
  Bottom 0.61: SCHOTTKY.A 60.33,76.83 | 65.56,74.93 65.88,74.61
  Bottom 0.813: 60.33,76.83 62.23,74.93 65.56,74.93
N$11
  Bottom 0.406: ZENER1.C R5.1 R4.1 66.66,71.95 UUSB.D-
N$12
  Bottom 0.406: R6.1 ZENER2.C 69.53,67.74 69.53,70.33 67.31,72.55 UUSB.D+
N$34
  Bottom 0.406: S10.SW- 33.02,39.74 D10.A
N$35
  Bottom 0.406: D9.A 13.97,40.59 S9.SW-
N$36
  Bottom 0.406: S11.SW- 52.07,41.54 D11.A
N$37
  Top 0.406: D20.C 71.25,57.15 S12.A
N$38
  Top 0.406: D19.C 65.91,57.15 S12.B
N$39
  Top 0.406: D18.C 52.2,57.15 S11.A
N$40
  Bottom 0.305: D12.A 69.27,40.7 S12.SW-
N$41
  Top 0.406: D16.C 33.15,57.15 S10.A
N$42
  Top 0.406: D15.C 27.81,57.15 S10.B
N$43
  Top 0.406: D14.C 14.1,57.15 S9.A
N$44
  Top 0.406: D13.C 8.76,57.15 S9.B
N$45
  Top 0.406: D17.C 46.86,57.15 S11.B
RST
  Bottom 0.254: ATMEGA328P.29 35.4,67.88 ATMEGA328P_TQFP.29
  Bottom 0.406: ATMEGA328P_TQFP.29 29.77,68.03 U$2.RST 21.03,74.94 R7.1 18.64,75.34 17.14,76.83 RST.2
RX
  Bottom 0.254: ATMEGA328P.30 36.4,68.38 35.88,68.9 35.47,68.9 ATMEGA328P_TQFP.30
  Bottom 0.406: ATMEGA328P_TQFP.30 31.51,68.83 U$2.RX
S1NODE
  Top 0.406: SW1.4 13.69,11.1 D21.A
  Bottom 0.406: S1.4 13.69,17.44 SW1.3 13.69,11.76 D21.A 13.69,11.1 SW1.4 13.69,5.42 S1.3
S2NODE
  Top 0.406: D22.A 32.74,11.1 SW2.3
  Bottom 0.406: 32.74,11.43 SW2.4 32.74,17.44 S2.4 | 32.74,11.43 SW2.3 32.74,5.42 S2.3 | D22.A 32.74,11.43
S3NODE
  Top 0.406: D23.A 51.79,11.1 SW3.3
  Bottom 0.406: S3.4 51.79,17.44 SW3.4 51.79,11.43 | 51.79,11.43 SW3.3 51.79,5.42 S3.3 | D23.A 51.79,11.43
S4NODE
  Top 0.406: D24.A 70.84,11.1 SW4.3
  Bottom 0.406: S4.3 70.84,5.42 SW4.3 70.84,11.43 | 70.84,11.43 SW4.4 70.84,17.44 S4.4 | D24.A 70.84,11.43
S5NODE
  Top 0.406: D25.A 13.69,30.15 SW5.3
  Bottom 0.406: 13.69,30.48 SW5.4 13.69,36.49 S5.4 | 13.69,30.48 SW5.3 13.69,24.47 S5.3 | D25.A 13.69,30.48
S6NODE
  Top 0.406: D26.A 32.74,30.15 SW6.3
  Bottom 0.406: 32.74,30.48 SW6.4 32.74,36.49 S6.4 | 32.74,30.48 SW6.3 32.74,24.47 S6.3 | D26.A 32.74,30.48
S7NODE
  Top 0.406: D27.A 51.79,30.15 SW7.3
  Bottom 0.406: 51.79,30.48 SW7.4 51.79,36.49 S7.4 | 51.79,30.48 SW7.3 51.79,24.47 S7.3 | D27.A 51.79,30.48
S8NODE
  Top 0.406: D28.A 70.84,30.15 SW8.3
  Bottom 0.406: 70.84,30.48 SW8.4 70.84,36.49 S8.4 | 70.84,30.48 SW8.3 70.84,24.47 S8.3 | D28.A 70.84,30.48
TX
  Bottom 0.254: ATMEGA328P.31 36.85,68.88 36.1,69.63 ATMEGA328P_TQFP.31 35.49,69.53
  Bottom 0.406: ATMEGA328P_TQFP.31 33.25,69.63 U$2.TX
VCC  (via drill 0.6)
  Top 0.61: LED13.1 18.75,22.55 | 18.01,41.29 LED14.1 | v36.83,73.82 36.83,73.66 34.29,71.12 34.29,70.17 | v20.32,62.23 21.59,63.5 27.62,63.5 34.29,70.17 | v41.59,61.12 41.91,61.44 41.91,62.55 34.29,70.17
  Top 0.813: v59.37,41.27 59.04,41.29 LED11.1 55.68,41.29 C_L1.2 54.51,40.54 53.66,39.69 v53.66,38.73 43.81,38.73 42.55,37.47 36.2,37.47 33.97,39.69 18.41,39.69 | 54.93,21.59 C_L2.2 | C_L2.2 54.71,21.59 v53.66,21.59 26.99,21.59 24.77,23.81 v20,23.81 18.75,22.55 | C_L2.2 55.68,22.55 LED12.1 | LED13.1 17.58,22.55 C_L3.2 | v18.38,39.65 LED14.1 | 18.01,41.29 17.58,41.29 C_L4.2 | U$2.VCC 45.09,73.03 47.62,73.03 v59.37,61.28
  Bottom 0.254: ATMEGA328P_TQFP.4 39.44,71.92 ATMEGA328P.4 | ATMEGA328P.6 40.44,70.92 40.96,71.44 40.96,71.85 ATMEGA328P_TQFP.6 | ATMEGA328P.18 40.94,64.79 41.59,64.14 41.59,63.43 ATMEGA328P_TQFP.18
  Bottom 0.406: U$2.VCC 41.6,76.52 C1.2 40.12,77.47 20.94,77.47 R7.2 | SCHOTTKY.C 58.29,73.98 63.34,73.98 64.66,72.66 R4.2 | ATMEGA328P_TQFP.18 41.69,61.21 v41.59,61.12
  Bottom 0.61: 54.8,77.47 SCHOTTKY.C | ATMEGA328P_TQFP.4 39.29,73.11 | ATMEGA328P_TQFP.6 40.89,73.11 | 40.89,73.11 39.29,73.11 | 40.89,73.11 42.72,74.94 U$2.VCC | v36.83,73.82 36.99,73.66 38.73,73.66 39.29,73.11 | v20.32,62.23 20.32,40.64 19.37,39.69 18.41,39.69
  Bottom 0.813: 54.8,77.47 45.71,77.47 U$2.VCC | v59.37,61.28 v59.37,41.27 61.62,41.27 LED21.1 | v53.66,38.73 v53.66,21.59 55.89,19.36 LED22.1 | LED23.1 20,20.98 v20,23.81 20,36.46 LED24.1 v18.38,39.65
XTAL1
  Bottom 0.254: ATMEGA328P.7 40.94,70.47 41.59,71.12 41.59,71.83 ATMEGA328P_TQFP.7 | C3.2 58.81,70.8 OSC1.2
  Bottom 0.305: ATMEGA328P_TQFP.7 41.69,72.64 41.91,72.87 43.81,72.87 44.29,72.39 53.98,72.39 55.24,71.12 OSC1.2
XTAL2
  Bottom 0.254: ATMEGA328P.8 41.44,70.33 42.55,71.44 42.55,71.86 ATMEGA328P_TQFP.8
  Bottom 0.305: OSC1.1 48.41,71.54 C4.1 42.87,71.54 ATMEGA328P_TQFP.8

### Text on the board
tNames: SW5 | SW6 | SW7 | SW8 | SW1 | SW2 | SW3 | SW4
bNames: hackaday.io/project/3502 v3.4 10/2015